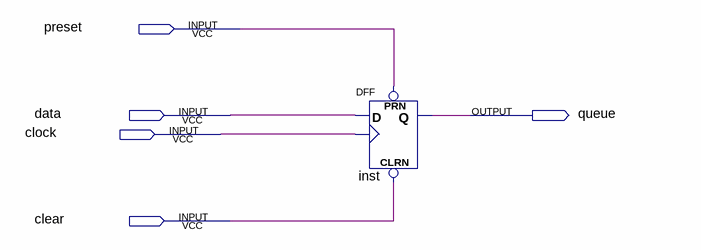
[diagram p0: schematic sheet]
// Quartus schematic D_Flip_Flop.bdf as structural Verilog: 1 symbols, 5 pins
module D_Flip_Flop (
  input  preset,
  input  data,
  input  clock,
  input  clear,
  output queue
);

  DFF inst (.CLRN(clear), .CLK(clock), .D(data), .PRN(preset), .Q(queue));
endmodule
